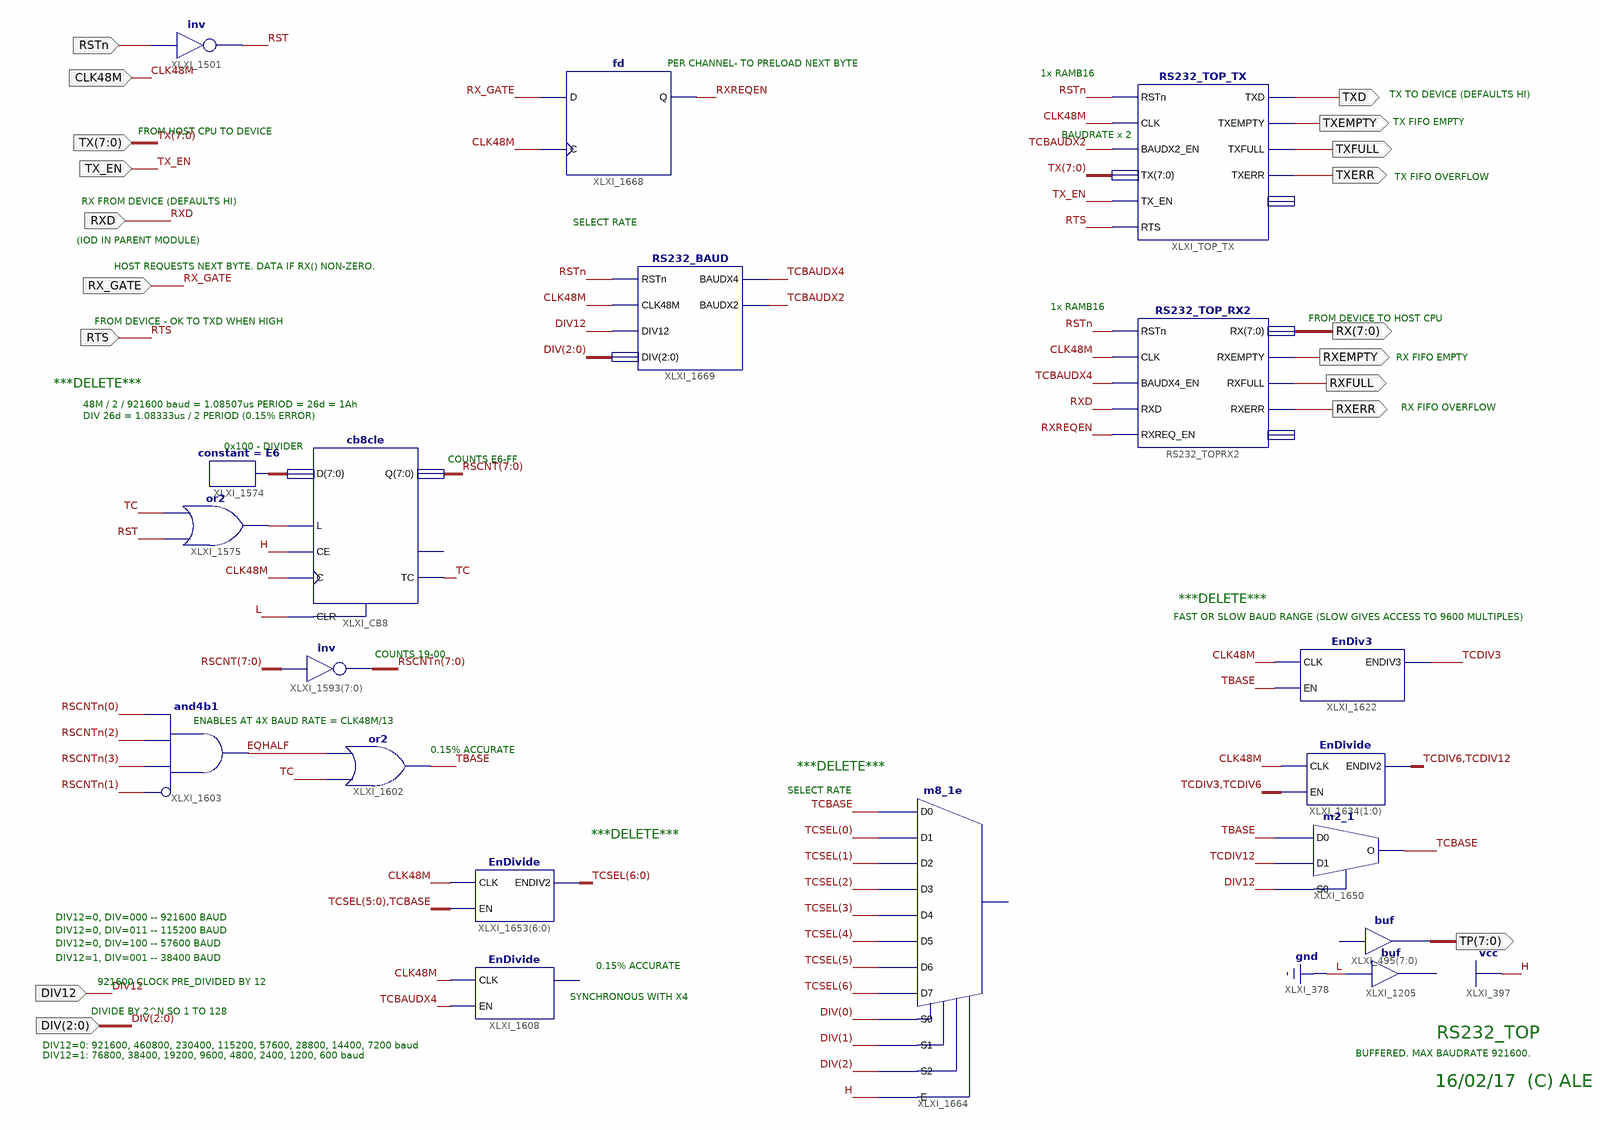
[diagram p0: schematic sheet 1]
// Xilinx ISE schematic RS232_TOP.sch (spartan3e) as structural Verilog: 19 symbols, 18 ports
module RS232_TOP (
  input  CLK48M,
  input  RSTn,
  input  RXD,
  input  [7:0] TX,
  input  TX_EN,
  input  RTS,
  input  DIV12,
  input  [2:0] DIV,
  input  RX_GATE,
  output [7:0] TP,
  output TXD,
  output TXEMPTY,
  output [7:0] RX,
  output TXERR,
  output TXFULL,
  output RXEMPTY,
  output RXFULL,
  output RXERR
);

  wire EQHALF, RST, RXREQEN, TBASE, TC, TCBASE, TCBAUDX2, TCBAUDX4, TCDIV3, TCDIV6, TCDIV12, XLXN_425;
  wire [6:0] TCSEL;
  wire [7:0] RSCNT, RSCNTn, XLXN_422;

  not XLXI_1501 (RST, RSTn);
  cb8cle XLXI_CB8 (.C(CLK48M), .CE(1'b1), .CLR(1'b0), .D(XLXN_422), .L(XLXN_425), .Q(RSCNT), .TC(TC));  // open: CEO
  constant #(.CValue("E6")) XLXI_1574 (.O(XLXN_422));
  or XLXI_1575 (XLXN_425, RST, TC);
  assign RSCNTn = ~RSCNT;  // inv XLXI_1593[7..0], 8 bits wide
  or XLXI_1602 (TBASE, TC, EQHALF);
  and XLXI_1603 (EQHALF, ~RSCNTn[1], RSCNTn[3], RSCNTn[2], RSCNTn[0]);  // and4b1
  // buf XLXI_495[7..0] has open pins: I=open, O=TP
  // buf XLXI_1205 has open pins: I=1'b0, O=open
  EnDivide XLXI_1608 (.CLK(CLK48M), .EN(TCBAUDX4));  // open: ENDIV2
  EnDivide XLXI_1653[6:0] (.CLK(CLK48M), .EN({TCSEL[5:0], TCBASE}), .ENDIV2(TCSEL));
  m8_1e XLXI_1664 (
    .D0(TCBASE), .D1(TCSEL[0]), .D2(TCSEL[1]), .D3(TCSEL[2]), .D4(TCSEL[3]), .D5(TCSEL[4]), .D6(TCSEL[5]),
    .D7(TCSEL[6]), .E(1'b1), .S0(DIV[0]), .S1(DIV[1]), .S2(DIV[2]));  // open: O
  EnDivide XLXI_1634[1:0] (.CLK(CLK48M), .EN({TCDIV3, TCDIV6}), .ENDIV2({TCDIV6, TCDIV12}));
  EnDiv3 XLXI_1622 (.CLK(CLK48M), .EN(TBASE), .ENDIV3(TCDIV3));
  m2_1 XLXI_1650 (.D0(TBASE), .D1(TCDIV12), .S0(DIV12), .O(TCBASE));
  RS232_TOP_TX XLXI_TOP_TX (
    .BAUDX2_EN(TCBAUDX2), .CLK(CLK48M), .RSTn(RSTn), .RTS(RTS), .TX(TX), .TXD(TXD), .TXEMPTY(TXEMPTY),
    .TXERR(TXERR), .TXFULL(TXFULL), .TX_EN(TX_EN));  // open: TP
  RS232_TOP_RX2 RS232_TOPRX2 (
    .BAUDX4_EN(TCBAUDX4), .CLK(CLK48M), .RSTn(RSTn), .RX(RX), .RXD(RXD), .RXEMPTY(RXEMPTY), .RXERR(RXERR),
    .RXFULL(RXFULL), .RXREQ_EN(RXREQEN));  // open: TP
  fd XLXI_1668 (.C(CLK48M), .D(RX_GATE), .Q(RXREQEN));
  RS232_BAUD XLXI_1669 (.BAUDX2(TCBAUDX2), .BAUDX4(TCBAUDX4), .CLK48M(CLK48M), .DIV(DIV), .DIV12(DIV12), .RSTn(RSTn));

  // Notes on the sheet:
  //   PER CHANNEL- TO PRELOAD NEXT BYTE
  //   1x RAMB16
  //   TX TO DEVICE (DEFAULTS HI)
  //   TX FIFO EMPTY
  //   FROM HOST CPU TO DEVICE
  //   BAUDRATE x 2
  //   TX FIFO OVERFLOW
  //   RX FROM DEVICE (DEFAULTS HI)
  //   SELECT RATE
  //   (IOD IN PARENT MODULE)
  //   HOST REQUESTS NEXT BYTE. DATA IF RX() NON-ZERO.
  //   1x RAMB16
  //   FROM DEVICE TO HOST CPU
  //   FROM DEVICE - OK TO TXD WHEN HIGH
  //   RX FIFO EMPTY
  //   ***DELETE***
  //   48M / 2 / 921600 baud = 1.08507us PERIOD = 26d = 1Ah
  //   RX FIFO OVERFLOW
  //   DIV 26d = 1.08333us / 2 PERIOD (0.15% ERROR)
  //   0x100 - DIVIDER
  //   COUNTS E6-FF
  //   ***DELETE***
  //   FAST OR SLOW BAUD RANGE (SLOW GIVES ACCESS TO 9600 MULTIPLES)
  //   COUNTS 19-00
  //   ENABLES AT 4X BAUD RATE = CLK48M/13
  //   0.15% ACCURATE
  //   ***DELETE***
  //   SELECT RATE
  //   ***DELETE***
  //   DIV12=0, DIV=000 -- 921600 BAUD
  //   DIV12=0, DIV=011 -- 115200 BAUD
  //   DIV12=0, DIV=100 -- 57600 BAUD
  //   DIV12=1, DIV=001 -- 38400 BAUD
  //   0.15% ACCURATE
  //   921600 CLOCK PRE_DIVIDED BY 12
  //   SYNCHRONOUS WITH X4
  //   DIVIDE BY 2^N SO 1 TO 128
  //   RS232_TOP
  //   DIV12=0: 921600, 460800, 230400, 115200, 57600, 28800, 14400, 7200 baud
  //   BUFFERED. MAX BAUDRATE 921600.
  //   DIV12=1: 76800, 38400, 19200, 9600, 4800, 2400, 1200, 600 baud
  //   16/02/17  (C) ALE
endmodule
